# Altium schematic sheet RP2040.SchDoc
size A; SheetNumber: 1; SheetTotal: 6
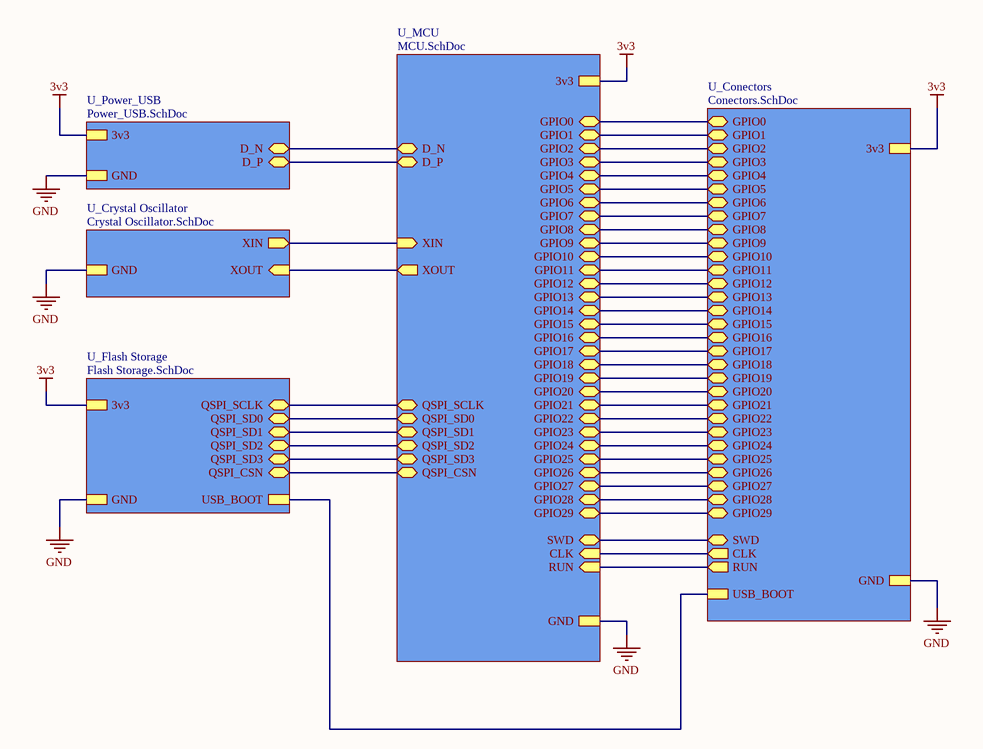
[diagram p0: RP2040.SchDoc]

## Sub-sheets
U_Conectors = Conectors.SchDoc: GPIO0 (bidir), GPIO1 (bidir), GPIO2 (bidir), GPIO3 (bidir), GPIO4 (bidir), GPIO5 (bidir), GPIO6 (bidir), GPIO7 (bidir), GPIO8 (bidir), GPIO9 (bidir), GPIO10 (bidir), GPIO11 (bidir), GPIO12 (bidir), GPIO13 (bidir), GPIO14 (bidir), GPIO15 (bidir), CLK (out), SWD (bidir), RUN (out), GPIO16 (bidir), GPIO17 (bidir), GPIO18 (bidir), GPIO19 (bidir), GPIO20 (bidir), GPIO21 (bidir), GPIO22 (bidir), GPIO23 (bidir), GPIO24 (bidir), GPIO25 (bidir), GPIO26 (bidir), GPIO27 (bidir), GPIO28 (bidir), GPIO29 (bidir), USB_BOOT, 3v3, GND
U_Crystal Oscillator = Crystal Oscillator.SchDoc: XIN (out), XOUT (in), GND
U_Flash Storage = Flash Storage.SchDoc: USB_BOOT, QSPI_SCLK (bidir), QSPI_SD0 (bidir), QSPI_SD1 (bidir), QSPI_SD2 (bidir), QSPI_SD3 (bidir), QSPI_CSN (bidir), 3v3, GND
U_MCU = MCU.SchDoc: GPIO0 (bidir), GPIO1 (bidir), GPIO2 (bidir), GPIO3 (bidir), GPIO4 (bidir), GPIO5 (bidir), GPIO6 (bidir), GPIO7 (bidir), GPIO8 (bidir), GPIO9 (bidir), GPIO10 (bidir), GPIO11 (bidir), GPIO12 (bidir), GPIO13 (bidir), GPIO14 (bidir), GPIO15 (bidir), SWD (bidir), RUN (in), GPIO16 (bidir), GPIO17 (bidir), GPIO18 (bidir), GPIO19 (bidir), GPIO20 (bidir), GPIO21 (bidir), GPIO22 (bidir), GPIO23 (bidir), GPIO24 (bidir), GPIO25 (bidir), GPIO26 (bidir), GPIO27 (bidir), GPIO28 (bidir), GPIO29 (bidir), CLK (in), XOUT (out), XIN (in), QSPI_SCLK (bidir), QSPI_SD0 (bidir), QSPI_SD1 (bidir), QSPI_SD2 (bidir), QSPI_SD3 (bidir), QSPI_CSN (bidir), 3v3, GND, D_N (bidir), D_P (bidir)
U_Power_USB = Power_USB.SchDoc: GND, 3v3, D_N (bidir), D_P (bidir)

## Nets
3v3: sheet U_Conectors/3v3, sheet U_Flash Storage/3v3, sheet U_MCU/3v3, sheet U_Power_USB/3v3
GND: sheet U_Conectors/GND, sheet U_Crystal Oscillator/GND, sheet U_Flash Storage/GND, sheet U_MCU/GND, sheet U_Power_USB/GND
(unnamed): sheet U_Conectors/GPIO0, sheet U_MCU/GPIO0
(unnamed): sheet U_Conectors/GPIO1, sheet U_MCU/GPIO1
(unnamed): sheet U_Conectors/GPIO2, sheet U_MCU/GPIO2
(unnamed): sheet U_Conectors/GPIO3, sheet U_MCU/GPIO3
(unnamed): sheet U_Conectors/GPIO4, sheet U_MCU/GPIO4
(unnamed): sheet U_Conectors/GPIO5, sheet U_MCU/GPIO5
(unnamed): sheet U_Conectors/GPIO6, sheet U_MCU/GPIO6
(unnamed): sheet U_Conectors/GPIO7, sheet U_MCU/GPIO7
(unnamed): sheet U_Conectors/GPIO8, sheet U_MCU/GPIO8
(unnamed): sheet U_Conectors/GPIO9, sheet U_MCU/GPIO9
(unnamed): sheet U_Conectors/GPIO10, sheet U_MCU/GPIO10
(unnamed): sheet U_Conectors/GPIO11, sheet U_MCU/GPIO11
(unnamed): sheet U_Conectors/GPIO12, sheet U_MCU/GPIO12
(unnamed): sheet U_Conectors/GPIO13, sheet U_MCU/GPIO13
(unnamed): sheet U_Conectors/GPIO14, sheet U_MCU/GPIO14
(unnamed): sheet U_Conectors/GPIO15, sheet U_MCU/GPIO15
(unnamed): sheet U_Conectors/CLK, sheet U_MCU/CLK
(unnamed): sheet U_Conectors/SWD, sheet U_MCU/SWD
(unnamed): sheet U_Conectors/RUN, sheet U_MCU/RUN
(unnamed): sheet U_Conectors/GPIO16, sheet U_MCU/GPIO16
(unnamed): sheet U_Conectors/GPIO17, sheet U_MCU/GPIO17
(unnamed): sheet U_Conectors/GPIO18, sheet U_MCU/GPIO18
(unnamed): sheet U_Conectors/GPIO19, sheet U_MCU/GPIO19
(unnamed): sheet U_Conectors/GPIO20, sheet U_MCU/GPIO20
(unnamed): sheet U_Conectors/GPIO21, sheet U_MCU/GPIO21
(unnamed): sheet U_Conectors/GPIO22, sheet U_MCU/GPIO22
(unnamed): sheet U_Conectors/GPIO23, sheet U_MCU/GPIO23
(unnamed): sheet U_Conectors/GPIO24, sheet U_MCU/GPIO24
(unnamed): sheet U_Conectors/GPIO25, sheet U_MCU/GPIO25
(unnamed): sheet U_Conectors/GPIO26, sheet U_MCU/GPIO26
(unnamed): sheet U_Conectors/GPIO27, sheet U_MCU/GPIO27
(unnamed): sheet U_Conectors/GPIO28, sheet U_MCU/GPIO28
(unnamed): sheet U_Conectors/GPIO29, sheet U_MCU/GPIO29
(unnamed): sheet U_Conectors/USB_BOOT, sheet U_Flash Storage/USB_BOOT
(unnamed): sheet U_Crystal Oscillator/XIN, sheet U_MCU/XIN
(unnamed): sheet U_Crystal Oscillator/XOUT, sheet U_MCU/XOUT
(unnamed): sheet U_Flash Storage/QSPI_SCLK, sheet U_MCU/QSPI_SCLK
(unnamed): sheet U_Flash Storage/QSPI_SD0, sheet U_MCU/QSPI_SD0
(unnamed): sheet U_Flash Storage/QSPI_SD1, sheet U_MCU/QSPI_SD1
(unnamed): sheet U_Flash Storage/QSPI_SD2, sheet U_MCU/QSPI_SD2
(unnamed): sheet U_Flash Storage/QSPI_SD3, sheet U_MCU/QSPI_SD3
(unnamed): sheet U_Flash Storage/QSPI_CSN, sheet U_MCU/QSPI_CSN
(unnamed): sheet U_MCU/D_N, sheet U_Power_USB/D_N
(unnamed): sheet U_MCU/D_P, sheet U_Power_USB/D_P